# EAGLE schematic Rev1 (EAGLE 7.2.0)
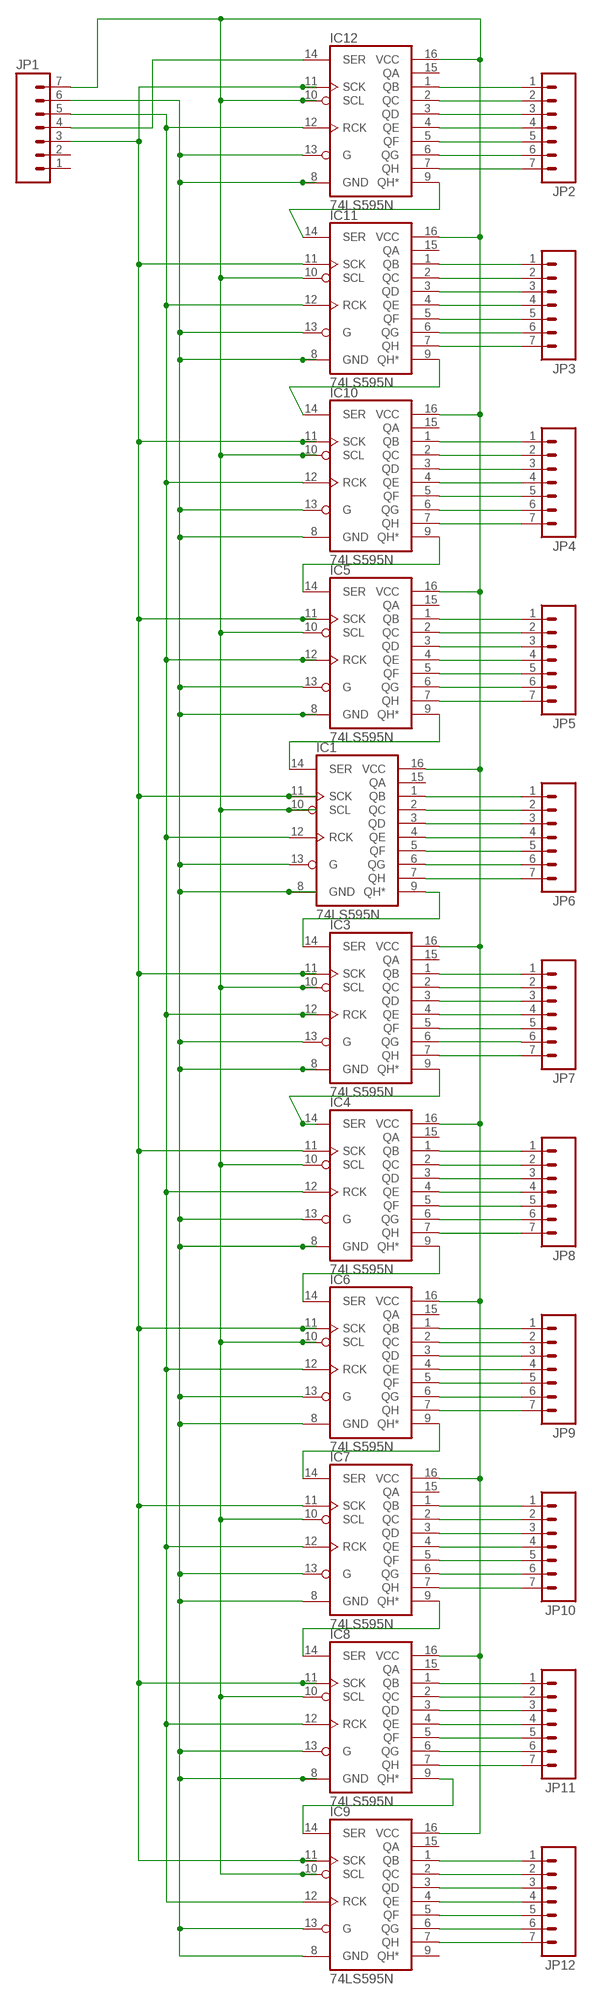
[diagram p0: schematic, sheet 1]

## Parts
IC1  74LS595N  [DIL16]
IC3  74LS595N  [DIL16]
IC4  74LS595N  [DIL16]
IC5  74LS595N  [DIL16]
IC6  74LS595N  [DIL16]
IC7  74LS595N  [DIL16]
IC8  74LS595N  [DIL16]
IC9  74LS595N  [DIL16]
IC10  74LS595N  [DIL16]
IC11  74LS595N  [DIL16]
IC12  74LS595N  [DIL16]
JP1  M07  [1X07]
JP2  M07  [1X07]
JP3  M07  [1X07]
JP4  M07  [1X07]
JP5  M07  [1X07]
JP6  M07  [1X07]
JP7  M07  [1X07]
JP8  M07  [1X07]
JP9  M07  [1X07]
JP10  M07  [1X07]
JP11  M07  [1X07]
JP12  M07  [1X07]

## Nets
GROUND: IC1.8(GND) IC1.13(G) IC3.8(GND) IC3.13(G) IC4.8(GND) IC4.13(G) IC5.8(GND) IC5.13(G) IC6.8(GND) IC6.13(G) IC7.8(GND) IC7.13(G) IC8.8(GND) IC8.13(G) IC9.8(GND) IC9.13(G) IC10.8(GND) IC10.13(G) IC11.8(GND) IC11.13(G) IC12.8(GND) IC12.13(G) JP1.6
LATCH: IC1.12(RCK) IC3.12(RCK) IC4.12(RCK) IC5.12(RCK) IC6.12(RCK) IC7.12(RCK) IC8.12(RCK) IC9.12(RCK) IC10.12(RCK) IC11.12(RCK) IC12.12(RCK) JP1.5
N$1: IC12.14(SER) JP1.4
N$2: IC11.14(SER) IC12.9(QH*)
N$3: IC10.14(SER) IC11.9(QH*)
N$4: IC5.14(SER) IC10.9(QH*)
N$5: IC1.14(SER) IC5.9(QH*)
N$6: IC1.9(QH*) IC3.14(SER)
N$7: IC3.9(QH*) IC4.14(SER)
N$8: IC4.9(QH*) IC6.14(SER)
N$9: IC6.9(QH*) IC7.14(SER)
N$10: IC7.9(QH*) IC8.14(SER)
N$11: IC8.9(QH*) IC9.14(SER)
N$12: IC1.11(SCK) IC3.11(SCK) IC4.11(SCK) IC5.11(SCK) IC6.11(SCK) IC7.11(SCK) IC8.11(SCK) IC9.11(SCK) IC10.11(SCK) IC11.11(SCK) IC12.11(SCK) JP1.3
N$13: IC12.1(QB) JP2.1
N$14: IC12.2(QC) JP2.2
N$15: IC12.3(QD) JP2.3
N$16: IC12.4(QE) JP2.4
N$17: IC12.5(QF) JP2.5
N$18: IC12.6(QG) JP2.6
N$19: IC12.7(QH) JP2.7
N$20: IC11.1(QB) JP3.1
N$21: IC11.2(QC) JP3.2
N$22: IC11.3(QD) JP3.3
N$23: IC11.4(QE) JP3.4
N$24: IC11.5(QF) JP3.5
N$25: IC11.6(QG) JP3.6
N$26: IC11.7(QH) JP3.7
N$27: IC10.1(QB) JP4.1
N$28: IC10.2(QC) JP4.2
N$29: IC10.3(QD) JP4.3
N$30: IC10.4(QE) JP4.4
N$31: IC10.5(QF) JP4.5
N$32: IC10.6(QG) JP4.6
N$33: IC10.7(QH) JP4.7
N$34: IC5.1(QB) JP5.1
N$35: IC5.2(QC) JP5.2
N$36: IC5.3(QD) JP5.3
N$37: IC5.4(QE) JP5.4
N$38: IC5.5(QF) JP5.5
N$39: IC5.6(QG) JP5.6
N$40: IC5.7(QH) JP5.7
N$41: IC3.1(QB) JP7.1
N$42: IC3.2(QC) JP7.2
N$43: IC3.3(QD) JP7.3
N$44: IC3.4(QE) JP7.4
N$45: IC3.5(QF) JP7.5
N$46: IC3.6(QG) JP7.6
N$47: IC3.7(QH) JP7.7
N$48: IC4.1(QB) JP8.1
N$49: IC4.2(QC) JP8.2
N$50: IC4.3(QD) JP8.3
N$51: IC4.4(QE) JP8.4
N$52: IC4.5(QF) JP8.5
N$53: IC4.6(QG) JP8.6
N$54: IC4.7(QH) JP8.7
N$55: IC6.1(QB) JP9.1
N$56: IC6.2(QC) JP9.2
N$57: IC6.3(QD) JP9.3
N$58: IC6.4(QE) JP9.4
N$59: IC6.5(QF) JP9.5
N$60: IC6.6(QG) JP9.6
N$61: IC6.7(QH) JP9.7
N$62: IC7.1(QB) JP10.1
N$63: IC7.2(QC) JP10.2
N$64: IC7.3(QD) JP10.3
N$65: IC7.4(QE) JP10.4
N$66: IC7.5(QF) JP10.5
N$67: IC7.6(QG) JP10.6
N$68: IC7.7(QH) JP10.7
N$69: IC8.1(QB) JP11.1
N$70: IC8.2(QC) JP11.2
N$71: IC8.3(QD) JP11.3
N$72: IC8.4(QE) JP11.4
N$73: IC8.5(QF) JP11.5
N$74: IC8.6(QG) JP11.6
N$75: IC8.7(QH) JP11.7
N$76: IC9.1(QB) JP12.1
N$77: IC9.2(QC) JP12.2
N$78: IC9.3(QD) JP12.3
N$79: IC9.4(QE) JP12.4
N$80: IC9.5(QF) JP12.5
N$81: IC9.6(QG) JP12.6
N$82: IC9.7(QH) JP12.7
N$83: IC1.1(QB) JP6.1
N$84: IC1.2(QC) JP6.2
N$85: IC1.3(QD) JP6.3
N$86: IC1.4(QE) JP6.4
N$87: IC1.5(QF) JP6.5
N$88: IC1.6(QG) JP6.6
N$89: IC1.7(QH) JP6.7
VCC: IC1.10(SCL) IC1.16(VCC) IC3.10(SCL) IC3.16(VCC) IC4.10(SCL) IC4.16(VCC) IC5.10(SCL) IC5.16(VCC) IC6.10(SCL) IC6.16(VCC) IC7.10(SCL) IC7.16(VCC) IC8.10(SCL) IC8.16(VCC) IC9.10(SCL) IC9.16(VCC) IC10.10(SCL) IC10.16(VCC) IC11.10(SCL) IC11.16(VCC) IC12.10(SCL) IC12.16(VCC) JP1.7
Unconnected: IC1.15(QA) IC3.15(QA) IC4.15(QA) IC5.15(QA) IC6.15(QA) IC7.15(QA) IC8.15(QA) IC9.9(QH*) IC9.15(QA) IC10.15(QA) IC11.15(QA) IC12.15(QA) JP1.1 JP1.2

## Library data of the parts
IC1 IC3-IC12 = SparkFun-DigitalIC:74*595: 8-bit SHIFT REGISTER, output latch
JP1-JP12 = SparkFun-Connectors:M07: Header 7 Standard 7-pin 0.1" header. Use with straight break away headers (SKU : PRT-00116), right angle break away headers (PRT-00553), swiss pins (PRT-00743), machine pins (PRT-00117), and female headers (PRT-00115). NOTES ON THE VARIANTS LOCK and LOCK_LONGPADS... This footprint was designed to help hold the alignment of a through-hole component (i.e. 7-pin header) while soldering it into place. You may notice that each hole has been shifted either up or down by 0.005 of an inch from it's more standard position (which is usually a perfectly straight line). This slight alteration caused the pins (the squares in the middle) to touch the edges of the holes. Because they are alternating, it causes a "brace" to hold the header in place. 0.005 has proven to be the perfect amount of "off-center" position when using our standard breakaway headers. Although looks a little odd when you look at the bare footprint, once you have a header in there, the alteration is very hard to notice. Also, if you push a header all the way into place, it is covered up entirely on the bottom side. This idea of altering the position of holes to aid alignment will be further integrated into the Sparkfun Library for other footprints. It can help hold any component with 3 or more connection pins.